# EAGLE design SHIFTER (EAGLE 7.5.0)
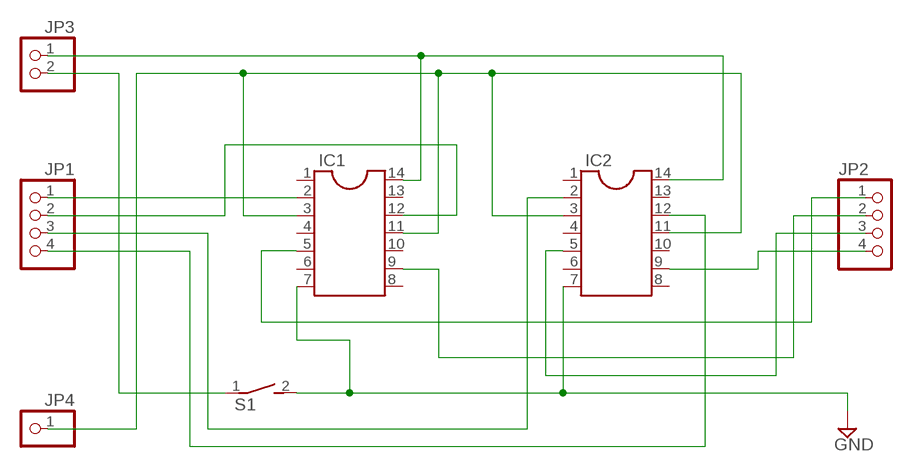
[diagram p0: schematic, sheet 1]

## Parts
IC1  DIL14  [DIL14]
IC2  DIL14  [DIL14]
JP1  PINHD-1X4  [1X04]
JP2  PINHD-1X4  [1X04]
JP3  PINHD-1X2  [1X02]
JP4  PINHD-1X1  [1X01]
S1  DS01E  [DS-01]

## Nets
GND: IC1.7 IC2.7 S1.2
N$1: IC1.5 JP2.1
N$2: IC1.9 JP2.2
N$3: IC2.5 JP2.3
N$4: IC2.9 JP2.4
N$5: IC1.2 JP1.1
N$6: IC1.12 JP1.2
N$7: IC2.2 JP1.3
N$8: IC2.12 JP1.4
N$9: IC1.3 IC1.11 IC2.3 IC2.11 JP4.1
N$10: IC1.14 IC2.14 JP3.1
N$13: JP3.2 S1.1
Unconnected: IC1.1 IC1.4 IC1.6 IC1.8 IC1.10 IC1.13 IC2.1 IC2.4 IC2.6 IC2.8 IC2.10 IC2.13

## Library data of the parts
IC1 IC2 = ic-package:DIL14: Dual In Line / Socket
JP1 JP2 = pinhead:PINHD-1X4: PIN HEADER
JP3 = pinhead:PINHD-1X2: PIN HEADER
JP4 = pinhead:PINHD-1X1: PIN HEADER
S1 = switch-dil:DS01E: DIL/CODE SWITCH; OC_FARNELL: unknown; OC_NEWARK: unknown

## Board
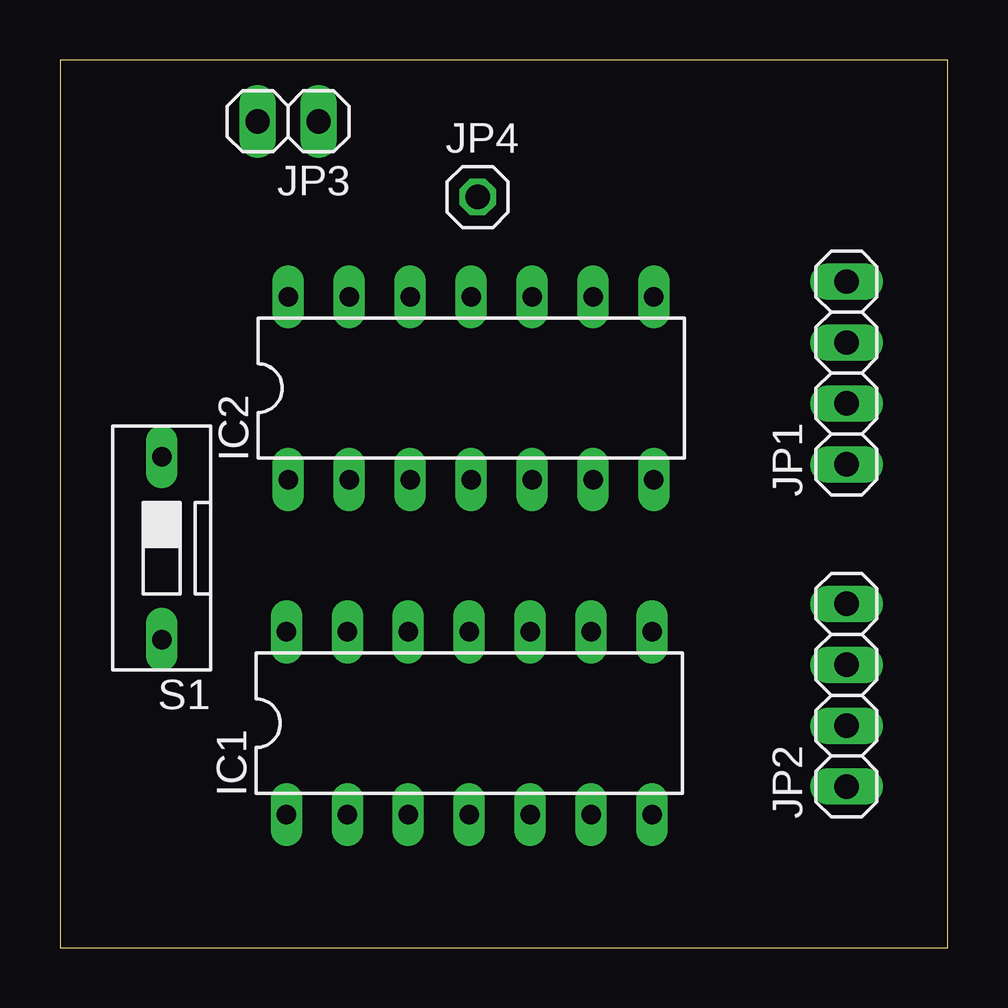
[diagram p1: board, top side]
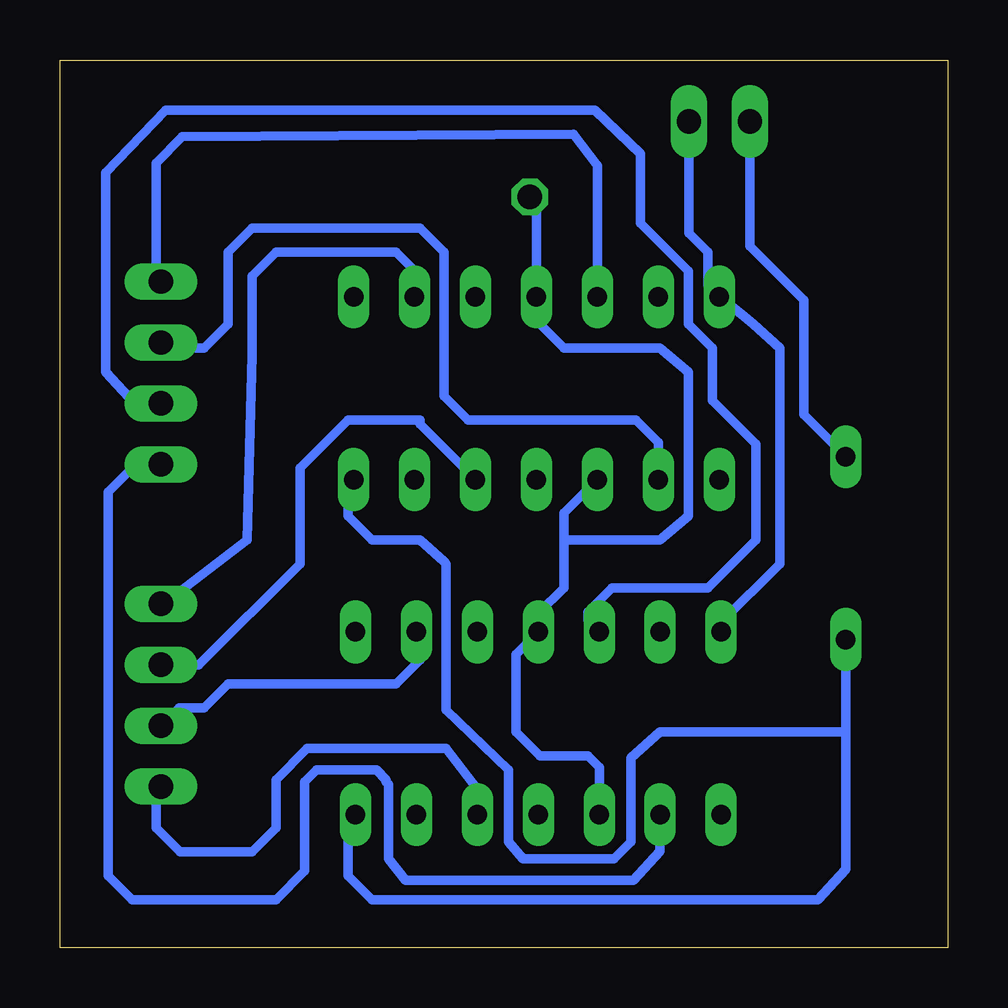
[diagram p2: board, bottom side, seen from below]

Size 37 x 37 mm. Coordinates in mm from the lower left corner, seen from the top.
Outline: 0,0 37,0 37,37 0,37 0,0
Copper layers (1*16): Top 0.035mm / dielectric 1.5mm / Bottom 0.035mm
Design rules "default": minimum track width 10mil, minimum drill 24mil, track to track 8mil, track to pad 8mil, pad to pad 8mil, via to via 8mil, smd to smd 8mil, copper to edge 40mil, drill to drill 8mil, minimum pad ring 10mil, minimum via ring 8mil, stop-mask expansion 4mil, vias tented up to drill 0mil, thermal gap 10mil

### Footprints (pad centres in the part's own frame; a part is rotated, then mirrored left to right if it is on the bottom)
DIL14 = drill 0.813 long: 1 -7.62,-3.81; 2 -5.08,-3.81; 3 -2.54,-3.81; 4 0,-3.81; 5 2.54,-3.81; 6 5.08,-3.81; 7 7.62,-3.81; 8 7.62,3.81; 9 5.08,3.81; 10 2.54,3.81; 11 0,3.81; 12 -2.54,3.81; 13 -5.08,3.81; 14 -7.62,3.81
1X04 = drill 1.016 long: 1 -3.81,0; 2 -1.27,0; 3 1.27,0; 4 3.81,0
1X02 = drill 1.016 long: 1 -1.27,0; 2 1.27,0
1X01 = drill 1.016 octagon: 1 0,0
DS-01 = drill 0.813 long: 1 0,-3.81; 2 0,3.81

### Placement (x,y rotation side)
IC1  17.06,9.35 0 top
IC2  17.14,23.32 0 top
JP1  32.79,23.95 90 top
JP2  32.79,10.52 90 top
JP3  9.51,34.44 180 top
JP4  17.41,31.29 0 top
S1  4.24,16.65 180 top

### Tracks (layer width: path | path; a pad name or v marks a point on that pad's centre or on a via)
GND
  Bottom 0.4: 4.24,9 S1.2 4.16,13.84 | 4.24,9 4.24,3.26 5.4,2 24,2 25,3 25,5.22 IC1.7 | 4.24,9 12,9 13.2,7.9 13.2,4.4 13.9,3.7 17.7,3.7 18.3,4.4 18.3,7.4 20.9,9.9 20.9,16 21,16.1 22,17 24,17 25,18 25,19.27 IC2.7
N$1
  Bottom 0.4: IC1.5 19.6,6.6 20.9,8.3 26.7,8.3 28,7 28,5 29,4 32,4 33,5 33,6.5 JP2.1
N$2
  Bottom 0.4: IC1.9 22.14,12.14 22,12 23,11 30,11 31,10 32.04,10 JP2.2
N$3
  Bottom 0.4: JP2.3 31.21,11.79 27,16 27,20 25,22 22,22 22,21.83 IC2.5
N$4
  Bottom 0.4: JP2.4 32.67,14.33 29.2,17 29,24.7 29,28 28,29 23,29 22,28 22,27.35 IC2.9
N$5
  Bottom 0.4: IC1.2 11.98,4.02 13.1,2.8 22.6,2.8 23.3,3.7 23.3,6.8 23.4,6.9 23.4,7 23.8,7.4 26.3,7.4 26.8,6.9 26.8,3.2 28,2 34,2 35,3 35,19 34,20 32.93,20 JP1.1
N$6
  Bottom 0.4: JP1.2 33.88,22.68 35.1,24 35.1,32.3 32.6,34.9 14.7,34.9 12.8,33.1 12.8,30.2 10.8,28.2 10.8,26 9.8,25 9.8,22.8 8,21 8,17 10,15 14,15 15,14 15,13.64 IC1.12
N$7
  Bottom 0.4: IC2.2 12.06,21.06 13,22 20,22 21,23 21,29 22,30 29,30 30,29 30,26 31,25 32.57,25 JP1.3
N$8
  Bottom 0.4: IC2.12 14.6,32.6 15.6,33.9 31.9,33.8 33,32.7 33,27.97 JP1.4
N$9
  Bottom 0.4: IC1.3 14.52,7.52 15,8 17,8 18,9 18,12.22 IC1.11 17.06,13.94 16,15 16,17 | 16,17 16,18.11 IC2.3 | 16,17 12,17 10.8,18 10.8,24 12,25 16,25 17,26 17,26.99 IC2.11 17.14,31.02 JP4.1
N$10
  Bottom 0.4: IC1.14 9.44,13.56 7,16 7,25 8.1,26 8.59,26.4 IC2.14 10,27.61 10,29 10.78,29.78 JP3.1
N$13
  Bottom 0.4: JP3.2 8.24,29.24 6,27 6,22.22 S1.1